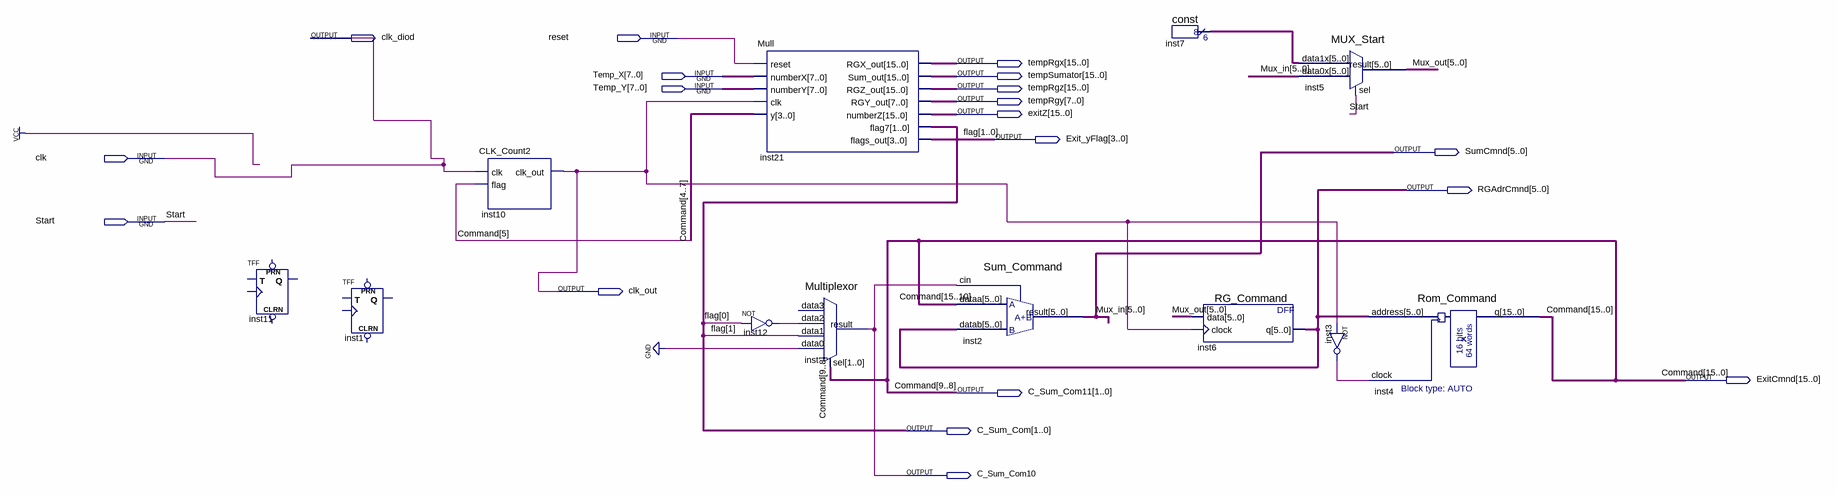
[diagram p0: schematic sheet]
// Quartus schematic Lab2.bdf as structural Verilog: 12 symbols, 19 pins
module Lab2 (
  input  reset,
  input  [7:0] Temp_X,
  input  [7:0] Temp_Y,
  input  clk,
  input  Start,
  output clk_diod,
  output [15:0] tempRgx,
  output [15:0] tempSumator,
  output [15:0] tempRgz,
  output [7:0] tempRgy,
  output [15:0] exitZ,
  output [3:0] Exit_yFlag,
  output [5:0] SumCmnd,
  output [5:0] RGAdrCmnd,
  output clk_out,
  output [15:0] ExitCmnd,
  output [1:0] C_Sum_Com11,
  output [1:0] C_Sum_Com,
  output C_Sum_Com10
);

  wire inst3_out, inst12_out;
  wire [5:0] inst7_result, Mux_out;

  TFF inst11 ();  // open: PRN, CLRN, T, CLK, Q
  TFF inst1 ();  // open: PRN, CLRN, T, CLK, Q
  CLK_Count2 inst10 (.clk(clk), .flag(ExitCmnd[5]), .clk_out(clk_out));
  Mull inst21 (
    .reset(reset), .numberX(Temp_X), .numberY(Temp_Y), .clk(clk_out),
    .y({ExitCmnd[4], ExitCmnd[5], ExitCmnd[6], ExitCmnd[7]}), .RGX_out(tempRgx), .Sum_out(tempSumator),
    .RGZ_out(tempRgz), .RGY_out(tempRgy), .numberZ(exitZ), .flag7(C_Sum_Com), .flags_out(Exit_yFlag));
  not inst12 (inst12_out, C_Sum_Com[0]);
  Multiplexor inst (
    .data2(inst12_out), .data1(C_Sum_Com[1]), .data0(1'b0), .sel(C_Sum_Com11), .result(C_Sum_Com10));  // open: data3
  Sum_Command inst2 (.dataa(ExitCmnd[15:10]), .datab(RGAdrCmnd), .cin(C_Sum_Com10), .result(SumCmnd));
  \const  inst7 (.result(inst7_result));
  RG_Command inst6 (.data(Mux_out), .clock(clk_out), .q(RGAdrCmnd));
  MUX_Start inst5 (.data1x(inst7_result), .data0x(SumCmnd), .sel(Start), .result(Mux_out));
  not inst3 (inst3_out, clk_out);
  Rom_Command inst4 (.address(RGAdrCmnd), .clock(inst3_out), .q({ExitCmnd[15:10], C_Sum_Com11, ExitCmnd[7:0]}));

  assign clk_diod = clk;
  assign ExitCmnd[9:8] = C_Sum_Com11;

  // Other names for the same wires on the sheet: Command[15:0] = {ExitCmnd[15:10], C_Sum_Com11, ExitCmnd[7:0]};
  //   flag[1:0] = C_Sum_Com; Mux_in[5:0] = SumCmnd
endmodule
